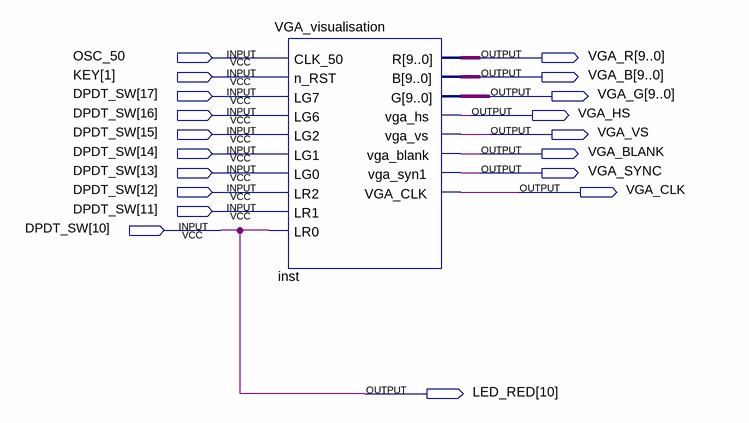
[diagram p0: schematic sheet]
// Quartus schematic VGA_TEST_BOARD.bdf as structural Verilog: 1 symbols, 19 pins
module VGA_TEST_BOARD (
  input  OSC_50,
  input  [1:1] KEY,
  input  [17:10] DPDT_SW,
  output [9:0] VGA_R,
  output [9:0] VGA_B,
  output [9:0] VGA_G,
  output VGA_HS,
  output VGA_VS,
  output VGA_BLANK,
  output VGA_SYNC,
  output VGA_CLK,
  output [10:10] LED_RED
);

  VGA_visualisation inst (
    .CLK_50(OSC_50), .n_RST(KEY[1]), .LG7(DPDT_SW[17]), .LG6(DPDT_SW[16]), .LG2(DPDT_SW[15]),
    .LG1(DPDT_SW[14]), .LG0(DPDT_SW[13]), .LR2(DPDT_SW[12]), .LR1(DPDT_SW[11]), .LR0(DPDT_SW[10]), .R(VGA_R),
    .B(VGA_B), .G(VGA_G), .vga_hs(VGA_HS), .vga_vs(VGA_VS), .vga_blank(VGA_BLANK), .vga_syn1(VGA_SYNC),
    .VGA_CLK(VGA_CLK));

  assign LED_RED[10] = DPDT_SW[10];
endmodule
